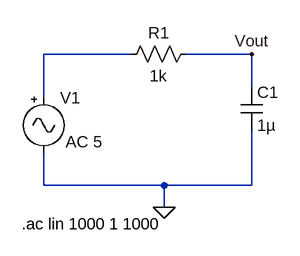
[diagram p0: schematic 3_12_pablo_gomez_tp6_ej1.asc]
3_12_pablo_gomez_tp6_ej1.asc, the LTspice schematic file:
Version 4
SHEET 1 880 680
WIRE 192 80 64 80
WIRE 368 80 272 80
WIRE 368 128 368 80
WIRE 64 144 64 80
WIRE 64 272 64 224
WIRE 240 272 64 272
WIRE 368 272 368 192
WIRE 368 272 240 272
WIRE 240 304 240 272
FLAG 368 80 Vout
FLAG 240 304 0
SYMBOL Misc\\signal 64 128 R0
WINDOW 123 32 80 Left 2
WINDOW 39 0 0 Left 0
SYMATTR Value2 AC 5
SYMATTR InstName V1
SYMATTR Value ""
SYMBOL res 288 64 R90
WINDOW 0 0 56 VBottom 2
WINDOW 3 32 56 VTop 2
SYMATTR InstName R1
SYMATTR Value 1k
SYMBOL cap 352 128 R0
SYMATTR InstName C1
SYMATTR Value 1µ
TEXT 32 328 Left 2 !.ac lin 1000 1 1000

The netlist it stands for:
* 3_12_pablo_gomez_tp6_ej1.asc
V1 N001 0 AC 5
R1 Vout N001 1k
C1 Vout 0 1µ
.ac lin 1000 1 1000
.backanno
.end